# Altium schematic sheet old.SchDoc: External Indicators
size A4; DocumentNumber: 7; SheetNumber: 7; SheetTotal: 8
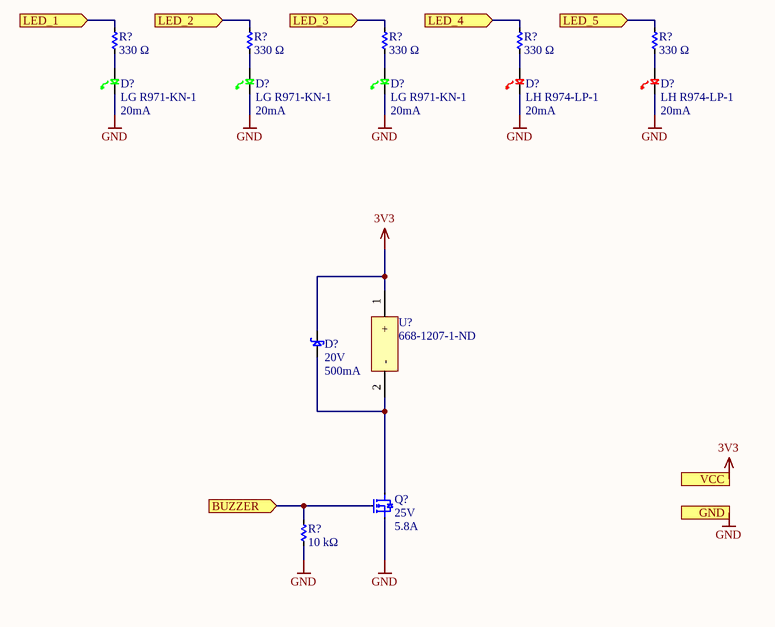
[diagram p0: old.SchDoc]

## Parts
(Parts that share a designator on the sheet are numbered #1, #2 ... from top to bottom, then left to right.)
D?#1  Manufacturer Part Number: LG R971-KN-1  Current - Test: 20mA  [0805_Diode]  (hidden comment: LED_LY971)
D?#2  Manufacturer Part Number: LG R971-KN-1  Current - Test: 20mA  [0805_Diode]  (hidden comment: LED_LY971)
D?#3  Manufacturer Part Number: LG R971-KN-1  Current - Test: 20mA  [0805_Diode]  (hidden comment: LED_LY971)
D?#4  Manufacturer Part Number: LH R974-LP-1  Current - Test: 20mA  [0805_Diode]  (hidden comment: LED_LY974)
D?#5  Manufacturer Part Number: LH R974-LP-1  Current - Test: 20mA  [0805_Diode]  (hidden comment: LED_LY974)
D?#6  Voltage - DC Reverse (Vr) (Max): 20V  Current - Average Rectified (Io): 500mA  [SOD123]  (hidden comment: SCHOTTKY_MBR0520L)
Q?  Drain to Source Voltage (Vdss): 25V  Current - Continuous Drain (Id) @ 25° C: 5.8A  [3SOT23]  (hidden comment: NFET_IRFML8244TRPBF)
R?#1  Resistance: 330 Ω  [R0603]  (hidden comment: __template_resistor)
R?#2  Resistance: 330 Ω  [R0603]  (hidden comment: __template_resistor)
R?#3  Resistance: 330 Ω  [R0603]  (hidden comment: __template_resistor)
R?#4  Resistance: 330 Ω  [R0603]  (hidden comment: __template_resistor)
R?#5  Resistance: 330 Ω  [R0603]  (hidden comment: __template_resistor)
R?#6  Resistance: 10 kΩ  [R0603]  (hidden comment: __template_resistor)
U?  Supplier Part Number 1: 668-1207-1-ND  [BUZ_SMT-0540-T-7-R]  (hidden comment: BUZ_SMT-0540-T-7-R)

## Ports
BUZZER (in), GND (in), LED_1 (in), LED_2 (in), LED_3 (in), LED_4 (in), LED_5 (in), VCC (in)

## Nets
3V3: D?#6.2 U?.1(+) ; port VCC
GND: D?#1.1 D?#2.1 D?#3.1 D?#4.1 D?#5.1 Q?.2 R?#6.2 ; port GND
BUZZER: Q?.1 R?#6.1 ; port BUZZER
LED_1: R?#1.2 ; port LED_1
LED_2: R?#2.2 ; port LED_2
LED_3: R?#3.2 ; port LED_3
LED_4: R?#4.2 ; port LED_4
LED_5: R?#5.2 ; port LED_5
NetD?#1_2: D?#1.2 R?#1.1
NetD?#2_2: D?#2.2 R?#2.1
NetD?#3_2: D?#3.2 R?#3.1
NetD?#4_2: D?#4.2 R?#4.1
NetD?#5_2: D?#5.2 R?#5.1
NetD?#6_1: D?#6.1 Q?.3 U?.2(-)

## Notes on the sheet
- Title
- Size:
- Date:
- A4
- Number:
- Time:
- Revision:
- Sheet
- of
- File:

## Library data of the parts
D?#1-D?#3 = LED_LY971: LED 0805 GREEN 20MA; Manufacturer: OSRAM Opto Semiconductors Inc; Wavelength - Dominant: 570nm; Wavelength - Peak: 572nm; Millicandela Rating: 26.05mcd; Voltage - Forward (Vf) (Typ): 2.2V; Viewing Angle: 160°; Lens Transparency: Diffused; Lens Color: White; Lens Style/Size: Rectangle with Flat Top, 1.30mm x 1.25mm; Supplier 1: Digi-Key; RoHS: RoHS Compliant; Category: Optoelectronics; Stock 1: 89733; Pricing 1: 1=0.08, 10=0.069, 100=0.0548, 250=0.04796, 500=0.04384 (USD); Packaging: Cut Tape (CT); Color: Green; Package / Case: 0805 (2012 Metric); Supplier Device Package: *; Size / Dimension: 2.00mm L x 1.25mm W; Height (Max): 0.80mm; Mounting Type: Surface Mount; ComponentLink1URL: http://www.osram-os.com/Graphics/XPic9/00078860_0.pdf; ComponentLink1Description: http://www.osram-os.com/Graphics/XPic9/00078860_0.pdf; Supplier Part Number 1: 475-1410-1-ND
D?#4 D?#5 = LED_LY974: LED 0805 RED 20MA; Manufacturer: OSRAM Opto Semiconductors Inc; Wavelength - Dominant: 645nm; Wavelength - Peak: 660nm; Millicandela Rating: 41mcd; Voltage - Forward (Vf) (Typ): 1.8V; Viewing Angle: 160°; Lens Transparency: Diffused; Lens Color: White; Lens Style/Size: Rectangle with Flat Top, 1.30mm x 1.25mm; Supplier 1: Digi-Key; RoHS: RoHS Compliant; Category: Optoelectronics; Stock 1: 66379; Pricing 1: 1=0.08, 10=0.07, 100=0.0559, 250=0.04892, 500=0.04472 (USD); Packaging: Cut Tape (CT); Color: Red; Package / Case: 0805 (2012 Metric); Supplier Device Package: *; Size / Dimension: 2.00mm L x 1.25mm W; Height (Max): 0.80mm; Mounting Type: Surface Mount; ComponentLink1URL: http://www.osram-os.com/Graphics/XPic8/00078869_0.pdf; ComponentLink1Description: http://www.osram-os.com/Graphics/XPic8/00078869_0.pdf; Supplier Part Number 1: 475-1415-1-ND
D?#6 = SCHOTTKY_MBR0520L: DIODE SCHOTTKY 0.5A 20V SOD-123; Manufacturer: Fairchild Semiconductor; Voltage - Forward (Vf) (Max) @ If: 385mV @ 500mA; Speed: Fast Recovery =< 500ns, > 200mA (Io); Current - Reverse Leakage @ Vr: 250µA @ 20V; Supplier 1: Digi-Key; Manufacturer Part Number: MBR0520L; RoHS: RoHS Compliant; Category: Discrete Semiconductor Products; Stock 1: 217232; Pricing 1: 1=0.63, 10=0.43, 100=0.2024, 250=0.1442, 500=0.11006, 750=0.08603, 1000=0.0759 (USD); Diode Type: Schottky; Reverse Recovery Time (trr): -; Capacitance @ Vr, F: -; Mounting Type: Surface Mount; Package / Case: SOD-123; Supplier Device Package: SOD-123; Packaging: Cut Tape (CT); ComponentLink1URL: http://www.fairchildsemi.com/ds/MB/MBR0520L.pdf; ComponentLink1Description: Datasheet; Supplier Part Number 1: MBR0520LCT-ND
Q? = NFET_IRFML8244TRPBF: MOSFET N-CH 25V 5.8A SOT23; Manufacturer: International Rectifier; FET Type: MOSFET N-Channel, Metal Oxide; FET Feature: Logic Level Gate; Rds On (Max) @ Id, Vgs: 24 mOhm @ 5.8A, 10V; Vgs(th) (Max) @ Id: 2.35V @ 10µA; Gate Charge (Qg) @ Vgs: 5.4nC @ 10V; Input Capacitance (Ciss) @ Vds: 430pF @ 10V; Power - Max: 1.25W; Supplier 1: Digi-Key; Manufacturer Part Number: IRFML8244TRPBF; RoHS: RoHS Compliant; Category: Discrete Semiconductor Products; Stock 1: 13542; Pricing 1: 1=0.41, 10=0.23, 100=0.1491, 250=0.13548, 500=0.1219, 1000=0.11411 (USD); Mounting Type: Surface Mount; Package / Case: TO-236-3, SC-59, SOT-23-3; Supplier Device Package: SOT-23; Packaging: Cut Tape (CT); ComponentLink1URL: http://www.irf.com/product-info/datasheets/data/irfml8244pbf.pdf; ComponentLink1Description: Datasheet; Supplier Part Number 1: IRFML8244TRPBFCT-ND
R?#1-R?#5 = RES SMD 330 OHM 1% 1/10W 0603: Manufacturer Part Number: RC0603FR-07330RL; Manufacturer: Yageo; Resistance (Sortable): 330; Power (Watts): 0.1W, 1/10W; Temperature Coefficient: ±100ppm/°C; Supplier 1: Digikey; Datasheets: http://www.yageo.com/documents/recent/PYu-RC_Group_51_RoHS_L_9.pdf; Image: //media.digikey.com/Renders/Yageo%20Renders/0603-(1608-Metric).jpg; Supplier Part Number 1: 311-330HRCT-ND; Tolerance: ±1%; Operating Temperature: -55°C ~ 155°C
R?#6 = RES SMD 10K OHM 1% 1/10W 0603: Manufacturer Part Number: RC0603FR-0710KL; Manufacturer: Yageo; Resistance (Sortable): 10000; Power (Watts): 0.1W, 1/10W; Temperature Coefficient: ±100ppm/°C; Supplier 1: Digikey; Datasheets: http://www.yageo.com/documents/recent/PYu-RC_Group_51_RoHS_L_9.pdf; Image: //media.digikey.com/Renders/Yageo%20Renders/0603-(1608-Metric).jpg; Supplier Part Number 1: 311-10.0KHRCT-ND; Tolerance: ±1%; Operating Temperature: -55°C ~ 155°C
U? = BUZ_SMT-0540-T-7-R: Peak-Peak Signal Buzzer Single Tone 4kHz Magnetic 2 ~ 4V 78dB @ 3V, 10cm; Manufacturer: PUI Audio, Inc.; Driver Circuitry: Transducer, Externally Driven; Voltage Range: 2 ~ 4V; Current - Supply: 100mA; Port Location: Top; Supplier 1: Digi-Key; Manufacturer Part Number: SMT-0540-T-7-R; RoHS: RoHS Compliant; Category: Audio Products; Stock 1: 12397; Pricing 1: 1=3.99, 10=3.325, 100=2.66, 500=2.3275 (USD); Packaging: Cut Tape (CT); Part Status: Active; Input Type: Peak-Peak Signal; Voltage - Rated: 3V; Frequency: 4kHz; Technology: Magnetic; Operating Mode: Single Tone; Duration: -; Sound Pressure Level: 78dB @ 3V, 10cm; Operating Temperature: -30°C ~ 70°C; Approvals: -; Ratings: -; Mounting Type: Surface Mount; Termination: Solder Pads; Size / Dimension: 5.0mm L x 5.0mm W x 2.1mm H; Height - Seated (Max): *; ComponentLink1URL: http://www.puiaudio.com/pdf/SMT-0540-T-7-R.pdf; ComponentLink1Description: http://www.puiaudio.com/pdf/SMT-0540-T-7-R.pdf